# EAGLE design socket (EAGLE 8.4.1)
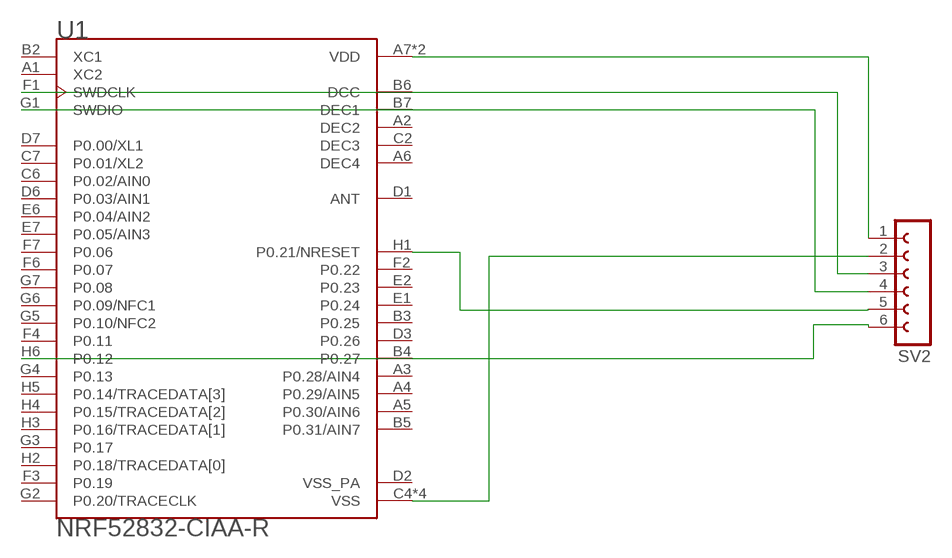
[diagram p0: schematic, sheet 1]

## Parts
SV2  FE06-1  [FE06]
U1  NRF52832-CIAA-R  [BGA50N40P7X8_300X320X40]

## Nets
N$1: SV2.1 U1.A7(VDD) U1.H7(VDD)
N$2: SV2.2 U1.C4(VSS) U1.C5(VSS) U1.E3(VSS) U1.F5(VSS)
N$3: SV2.3 U1.F1(SWDCLK)
N$4: SV2.4 U1.G1(SWDIO)
N$5: SV2.5 U1.H1(P0.21/NRESET)
N$6: SV2.6 U1.H6(P0.12)
Unconnected: U1.A1(XC2) U1.A3(P0.28/AIN4) U1.A4(P0.29/AIN5) U1.A5(P0.30/AIN6) U1.B2(XC1) U1.B3(P0.25) U1.B4(P0.27) U1.B5(P0.31/AIN7) U1.C6(P0.02/AIN0) U1.C7(P0.01/XL2) U1.D1(ANT) U1.D3(P0.26) U1.D6(P0.03/AIN1) U1.D7(P0.00/XL1) U1.E1(P0.24) U1.E2(P0.23) U1.E6(P0.04/AIN2) U1.E7(P0.05/AIN3) U1.F2(P0.22) U1.F3(P0.19) U1.F4(P0.11) U1.F6(P0.07) U1.F7(P0.06) U1.G2(P0.20/TRACECLK) U1.G3(P0.17) U1.G4(P0.13) U1.G5(P0.10/NFC2) U1.G6(P0.09/NFC1) U1.G7(P0.08) U1.H2(P0.18/TRACEDATA[0]) U1.H3(P0.16/TRACEDATA[1]) U1.H4(P0.15/TRACEDATA[2]) U1.H5(P0.14/TRACEDATA[3])

## Power pins joined to a net without a drawn wire
DCC: U1.B6(DCC)
DEC1: U1.B7(DEC1)
DEC2: U1.A2(DEC2)
DEC3: U1.C2(DEC3)
DEC4: U1.A6(DEC4)
VSS_PA: U1.D2(VSS_PA)

## Library data of the parts
SV2 = con-lsta:FE06-1: FEMALE HEADER; OC_FARNELL: unknown; OC_NEWARK: unknown
U1 = NRF52832-CIAA-R:NRF52832-CIAA-R: Multi Protocal Bluetooth Smart ANT 2.4GHz RF SoC (WL-CSP); DESCRIPTION: Multi Protocal Bluetooth Smart ANT 2.4GHz RF SoC (WL-CSP); DIGI-KEY_PART_NUMBER: 1490-1056-1-ND; DIGI-KEY_PURCHASE_URL: https://www.digikey.com/product-detail/en/nordic-semiconductor-asa/NRF52832-CIAA-R/1490-1056-1-ND/6071168?WT.z_cid=ref_snapeda; MF: Nordic Semiconductor; MP: NRF52832-CIAA-R; PACKAGE: XFBGA-50 Nordic Semiconductor

## Board
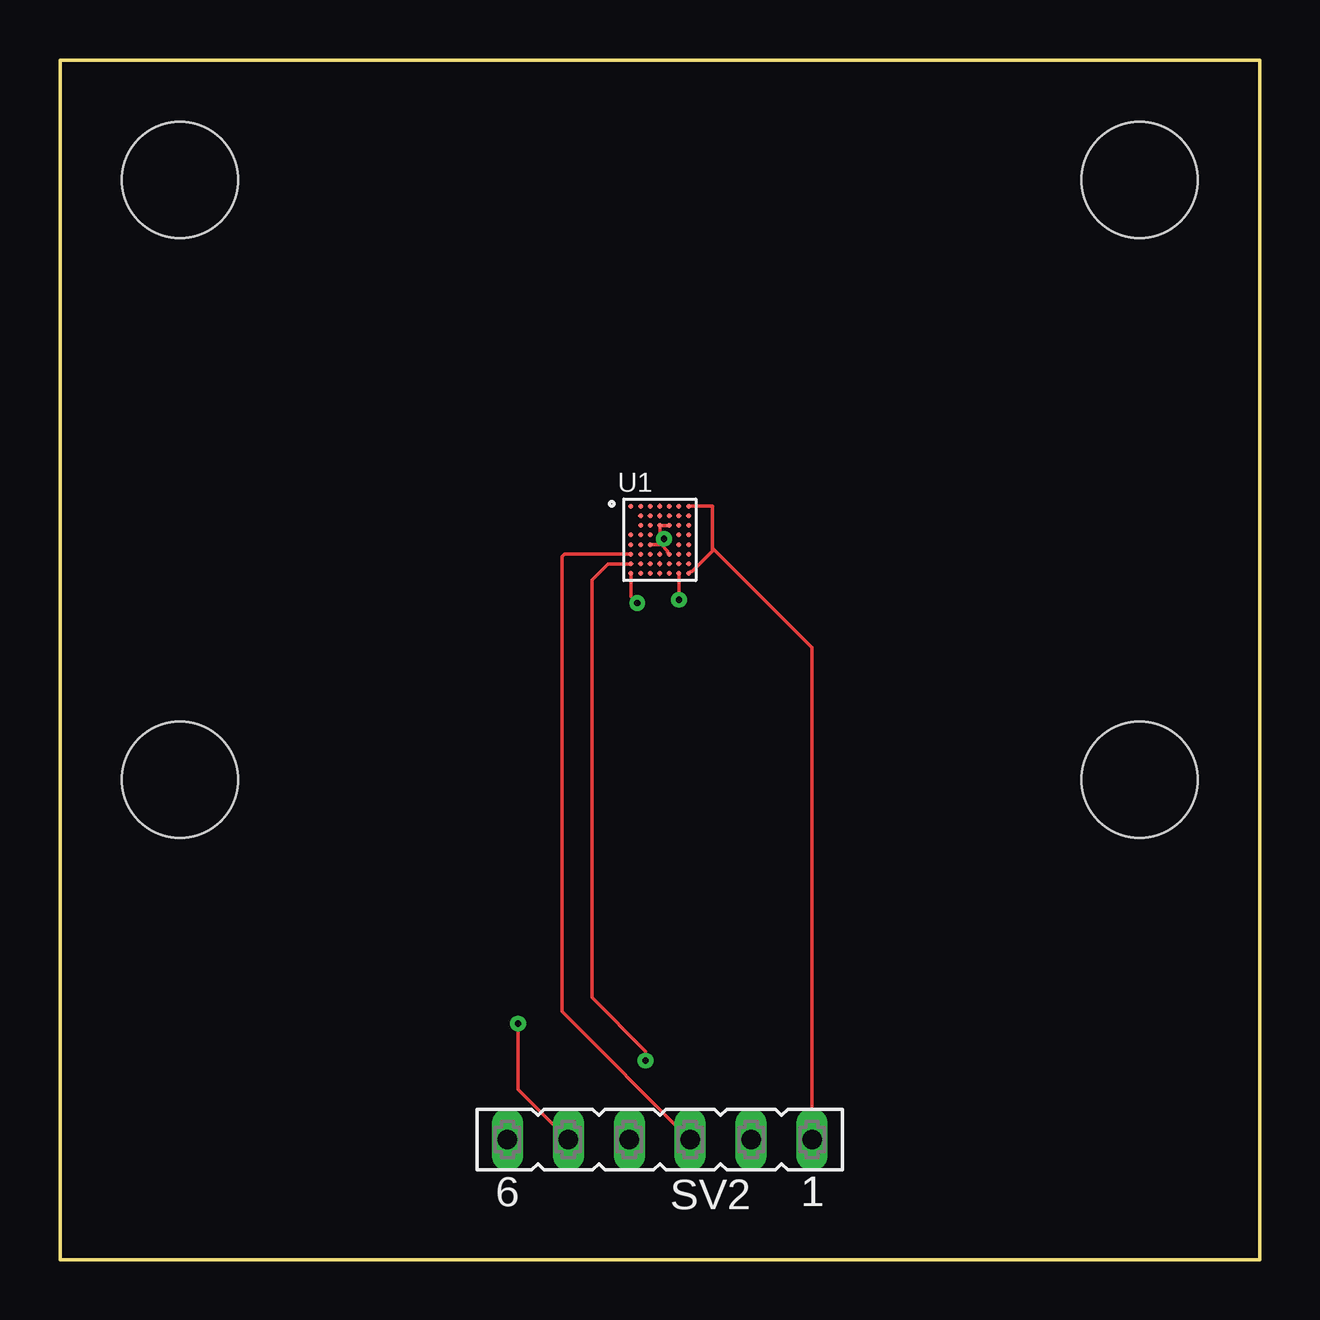
[diagram p1: board, top side]
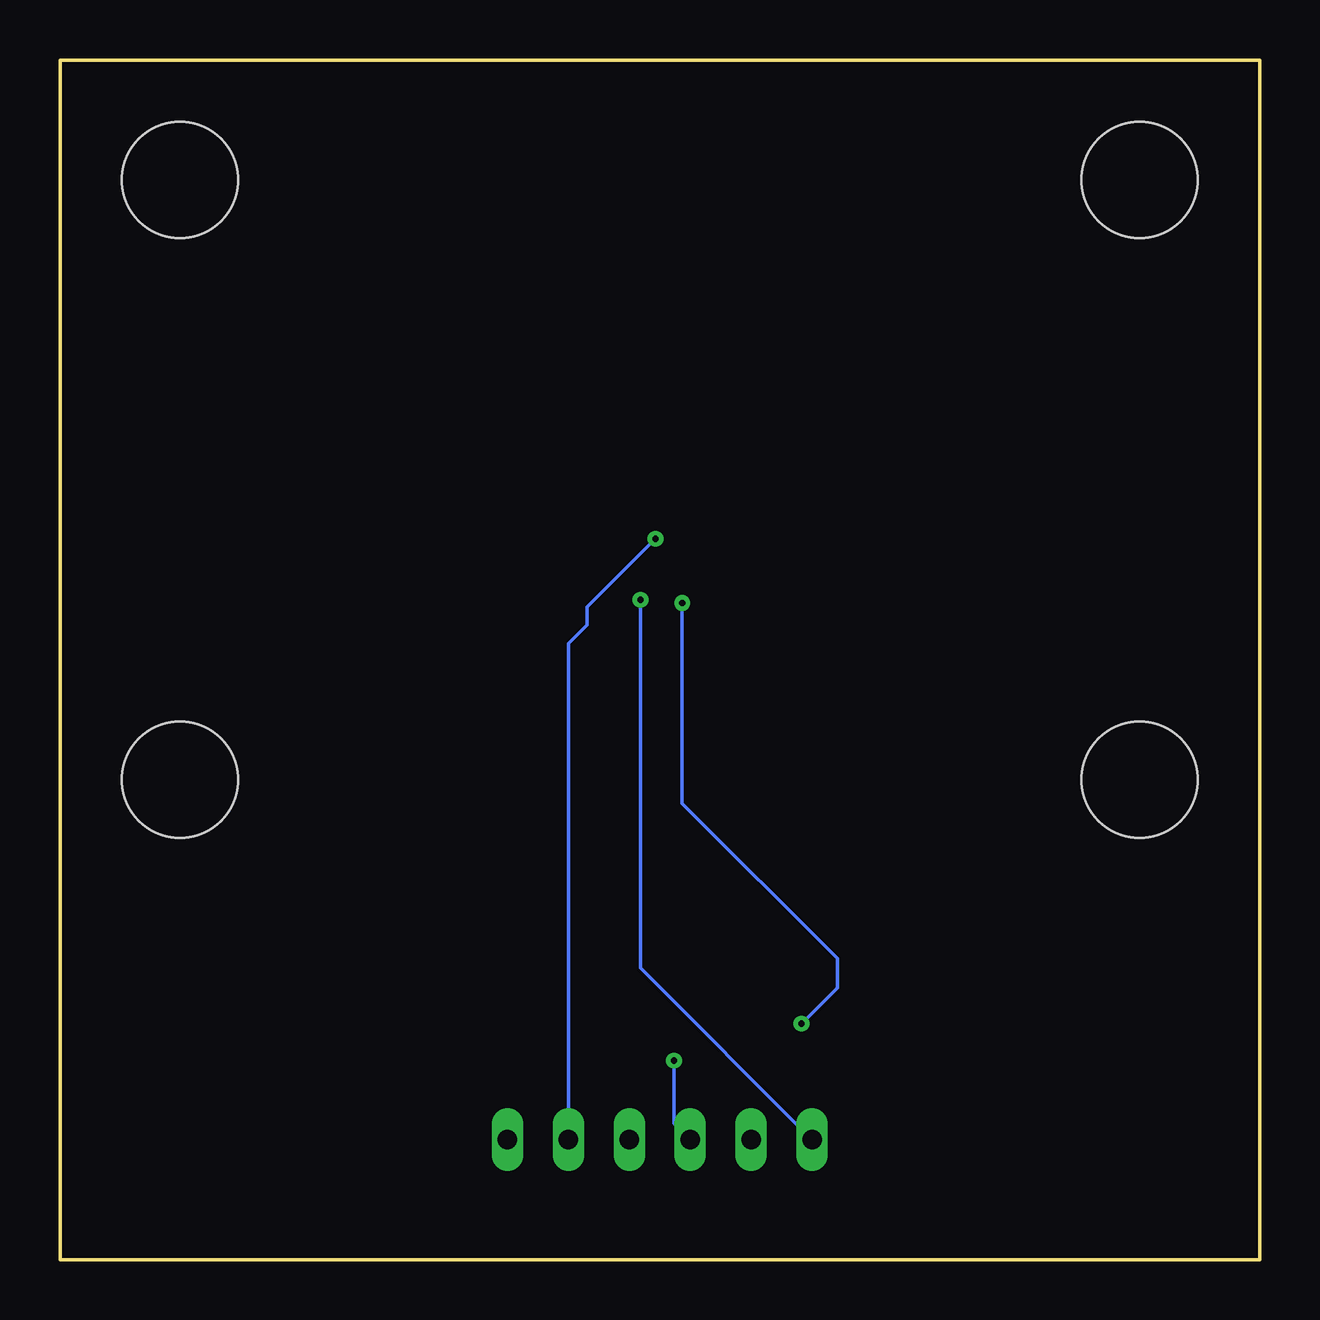
[diagram p2: board, bottom side, seen from below]

Size 50 x 50 mm. Coordinates in mm from the lower left corner, seen from the top.
Outline: 0,0 50,0 50,50 0,50 0,0
Copper layers (1*16): Top 0.035mm / dielectric 1.5mm / Bottom 0.035mm
Design rules "default *": minimum track width 6mil, minimum drill 10mil, track to track 6mil, track to pad 6mil, pad to pad 6mil, via to via 6mil, smd to smd 6mil, copper to edge 40mil, drill to drill 6mil, minimum pad ring 10mil, minimum via ring 8mil, stop-mask expansion 4mil, vias tented up to drill 0mil, thermal gap 10mil
Holes 4.83 mm at 5,45 45,45 5,20 45,20

### Footprints (pad centres in the part's own frame; a part is rotated, then mirrored left to right if it is on the bottom)
FE06 = drill 0.813 long: 1 -6.35,0; 2 -3.81,0; 3 -1.27,0; 4 1.27,0; 5 3.81,0; 6 6.35,0
BGA50N40P7X8_300X320X40 = smd 0.2 x 0.2: A1 -1.2,1.4; A2 -0.8,1.4; A3 -0.4,1.4; A4 0,1.4; A5 0.4,1.4; A6 0.8,1.4; A7 1.2,1.4; B2 -0.8,1; B3 -0.4,1; B4 0,1; B5 0.4,1; B6 0.8,1; B7 1.2,1; C2 -0.8,0.6; C3 -0.4,0.6; C4 0,0.6; C5 0.4,0.6; C6 0.8,0.6; C7 1.2,0.6; D1 -1.2,0.2; D2 -0.8,0.2; D3 -0.4,0.2; D6 0.8,0.2; D7 1.2,0.2; E1 -1.2,-0.2; E2 -0.8,-0.2; E3 -0.4,-0.2; E6 0.8,-0.2; E7 1.2,-0.2; F1 -1.2,-0.6; F2 -0.8,-0.6; F3 -0.4,-0.6; F4 0,-0.6; F5 0.4,-0.6; F6 0.8,-0.6; F7 1.2,-0.6; G1 -1.2,-1; G2 -0.8,-1; G3 -0.4,-1; G4 0,-1; G5 0.4,-1; G6 0.8,-1; G7 1.2,-1; H1 -1.2,-1.4; H2 -0.8,-1.4; H3 -0.4,-1.4; H4 0,-1.4; H5 0.4,-1.4; H6 0.8,-1.4; H7 1.2,-1.4

### Placement (x,y rotation side)
SV2  25,5 180 top
U1  25,30 0 top

### Tracks (layer width: path | path; a pad name or v marks a point on that pad's centre or on a via)
N$1
  Top 0.152: U1.H7 26.27,28.67 26.34,28.67 27.21,29.54 27.21,29.65 | 27.21,29.65 27.21,31.41 27.2,31.4 U1.A7 | 27.21,29.65 31.35,25.5 SV2.1
N$2  (via drill 0.25 pad 0.51)
  Top 0.152: U1.C5 U1.C4 25,29.83 24.97,29.8 | U1.F5 25.33,29.47 25.33,29.54 25.07,29.8 24.97,29.8 | U1.E3 24.97,29.8 | 24.97,29.8 24.97,29.83 v25.18,30.04
  Bottom 0.152: v25.18,30.04 28.04,27.19 28.04,26.45 28.81,25.67 SV2.2
N$3
  Top 0.152: U1.F1 21.02,29.4 20.93,29.31 20.93,10.34 SV2.3
N$4  (via drill 0.25 pad 0.51)
  Top 0.152: U1.G1 22.84,29 22.17,28.33 22.17,10.93 24.41,8.68 v24.41,8.29
  Bottom 0.152: v24.41,8.29 24.41,5.68 SV2.4
N$5  (via drill 0.25 pad 0.51)
  Top 0.152: U1.H1 23.8,27.63 v24.06,27.37 | v19.1,9.83 19.1,7.09 SV2.5
  Bottom 0.152: v24.06,27.37 24.06,19.02 17.6,12.55 17.6,11.33 v19.1,9.83
N$6  (via drill 0.25 pad 0.51)
  Top 0.152: U1.H6 v25.8,27.5
  Bottom 0.152: v25.8,27.5 25.8,12.15 SV2.6